# EAGLE schematic lcd (EAGLE 7.4.0)
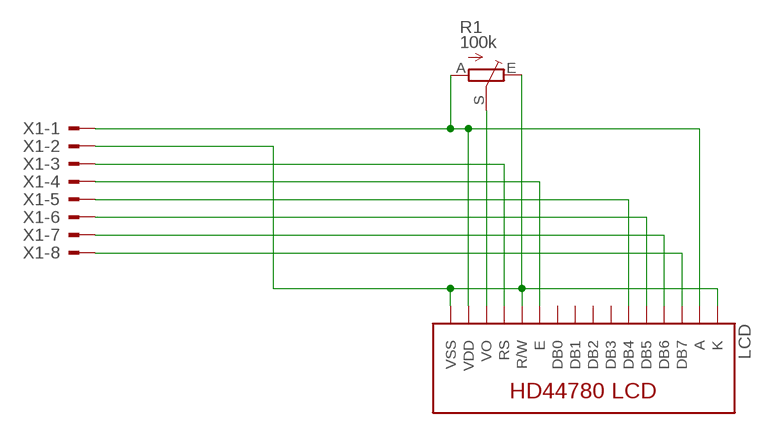
[diagram p0: schematic, sheet 1]

## Parts
LCD  LCD-HD447804-HOLES16X2-4-HOLES  [LCD-16X2-4HOLES]
R1  100k  TRIM_EU-B25P  [B25P]
X1  741256-49  [741256-49]

## Nets
N$1: LCD.4(RS) X1.3
N$2: LCD.6(E) X1.4
N$3: LCD.11(DB4) X1.5
N$4: LCD.12(DB5) X1.6
N$5: LCD.13(DB6) X1.7
N$6: LCD.14(DB7) X1.8
N$7: LCD.1(VSS) LCD.5(R/W) LCD.16(K) R1.E X1.2
N$9: LCD.2(VDD) LCD.15(A) R1.A X1.1
N$10: LCD.3(VO) R1.S
Unconnected: LCD.7(DB0) LCD.8(DB1) LCD.9(DB2) LCD.10(DB3)

## Library data of the parts
LCD = HD44780LCD:LCD-HD44780
R1 = pot:TRIM_EU-: POTENTIOMETER
X1 = con-conrad:741256-49: Connector with Kabel